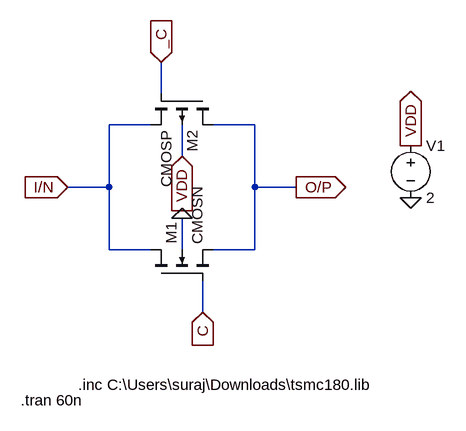
[diagram p0: schematic TransGate_180nm.asc]
TransGate_180nm.asc, the LTspice schematic file:
Version 4
SHEET 1 920 680
WIRE 176 80 176 32
WIRE 160 128 96 128
WIRE 320 128 256 128
WIRE 208 176 208 128
WIRE 96 224 96 128
WIRE 96 224 32 224
WIRE 320 224 320 128
WIRE 384 224 320 224
WIRE 96 320 96 224
WIRE 160 320 96 320
WIRE 208 320 208 272
WIRE 320 320 320 224
WIRE 320 320 256 320
WIRE 240 416 240 368
FLAG 32 224 I/N
IOPIN 32 224 In
FLAG 384 224 O/P
IOPIN 384 224 Out
FLAG 176 32 _C
IOPIN 176 32 In
FLAG 240 416 C
IOPIN 240 416 In
FLAG 208 176 VDD
IOPIN 208 176 In
FLAG 208 272 0
FLAG 560 240 0
FLAG 560 160 VDD
IOPIN 560 160 Out
SYMBOL nmos4 160 368 R270
SYMATTR InstName M1
SYMATTR Value CMOSN
SYMATTR Value2 l=0.18u w=10u
SYMBOL pmos4 256 80 R90
SYMATTR InstName M2
SYMATTR Value CMOSP
SYMATTR Value2 l=0.18u w=20u
SYMBOL voltage 560 144 R0
WINDOW 123 0 0 Left 0
WINDOW 39 0 0 Left 0
SYMATTR InstName V1
SYMATTR Value 2
TEXT 48 528 Left 2 !.inc C:\\Users\\suraj\\Downloads\\tsmc180.lib
TEXT -40 552 Left 2 !.tran 60n

The netlist it stands for:
* TransGate_180nm.asc
M1 I/N C O/P 0 CMOSN l=0.18u w=10u
M2 O/P _C I/N VDD CMOSP l=0.18u w=20u
V1 VDD 0 2
.model NMOS NMOS
.model PMOS PMOS
.lib standard.mos
.inc C:\Users\suraj\Downloads\tsmc180.lib
.tran 60n
.backanno
.end